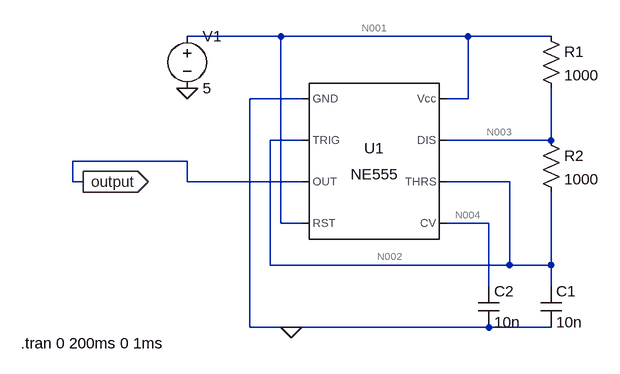
[diagram p0: schematic Draft1.asc]
Draft1.asc, the LTspice schematic file:
Version 4
SHEET 1 880 680
WIRE 48 -48 -96 -48
WIRE 336 -48 48 -48
WIRE 464 -48 336 -48
WIRE 80 48 0 48
WIRE 336 48 336 -48
WIRE 336 48 304 48
WIRE 80 112 32 112
WIRE 464 112 464 32
WIRE 464 112 304 112
WIRE -96 144 -272 144
WIRE -272 176 -272 144
WIRE -256 176 -272 176
WIRE -96 176 -96 144
WIRE 80 176 -96 176
WIRE 400 176 304 176
WIRE 48 240 48 -48
WIRE 80 240 48 240
WIRE 368 240 304 240
WIRE 32 304 32 112
WIRE 400 304 400 176
WIRE 400 304 32 304
WIRE 464 304 464 192
WIRE 464 304 400 304
WIRE 368 336 368 240
WIRE 464 336 464 304
WIRE 0 400 0 48
WIRE 64 400 0 400
WIRE 368 400 64 400
WIRE 464 400 368 400
FLAG 64 400 0
FLAG -256 176 output
IOPIN -256 176 Out
FLAG -96 32 0
SYMBOL res 448 -64 R0
SYMATTR InstName R1
SYMATTR Value 1000
SYMBOL res 448 96 R0
SYMATTR InstName R2
SYMATTR Value 1000
SYMBOL cap 448 336 R0
SYMATTR InstName C1
SYMATTR Value 10n
SYMBOL cap 352 336 R0
SYMATTR InstName C2
SYMATTR Value 10n
SYMBOL Misc\\NE555 192 144 R0
SYMATTR InstName U1
SYMBOL voltage -96 -64 R0
SYMATTR InstName V1
SYMATTR Value 5
TEXT -352 424 Left 2 !.tran 0 200ms 0 1ms

The netlist it stands for:
* Draft1.asc
R1 N001 N003 1000
R2 N003 N002 1000
C1 N002 0 10n
C2 N004 0 10n
XU1 0 N002 output N001 N004 N002 N003 N001 NE555  ; pins GND TRIG OUT RST CV THRS DIS Vcc
V1 N001 0 5
.tran 0 200ms 0 1ms
.lib NE555.sub
.backanno
.end

* Results of the author's LTspice run, read from the files saved beside the schematic
* Operating Point, zero values left out:
*   V(n001) = 5 V
*   V(n003) = 5 V
*   V(n002) = 5 V
*   V(n004) = 3.333 V
*   V(output) = 5 V
*   I(R2) = 10 nA
*   I(R1) = 16.67 nA
*   I(V1) = -1.611 mA
*   Ix(u1:1) = -1.611 mA
*   Ix(u1:2) = 5 nA
*   Ix(u1:4) = 22.67 µA
*   Ix(u1:6) = 5 nA
*   Ix(u1:7) = 6.672 nA
*   Ix(u1:8) = 1.588 mA